# Altium project PCB_Project.PrjPcb
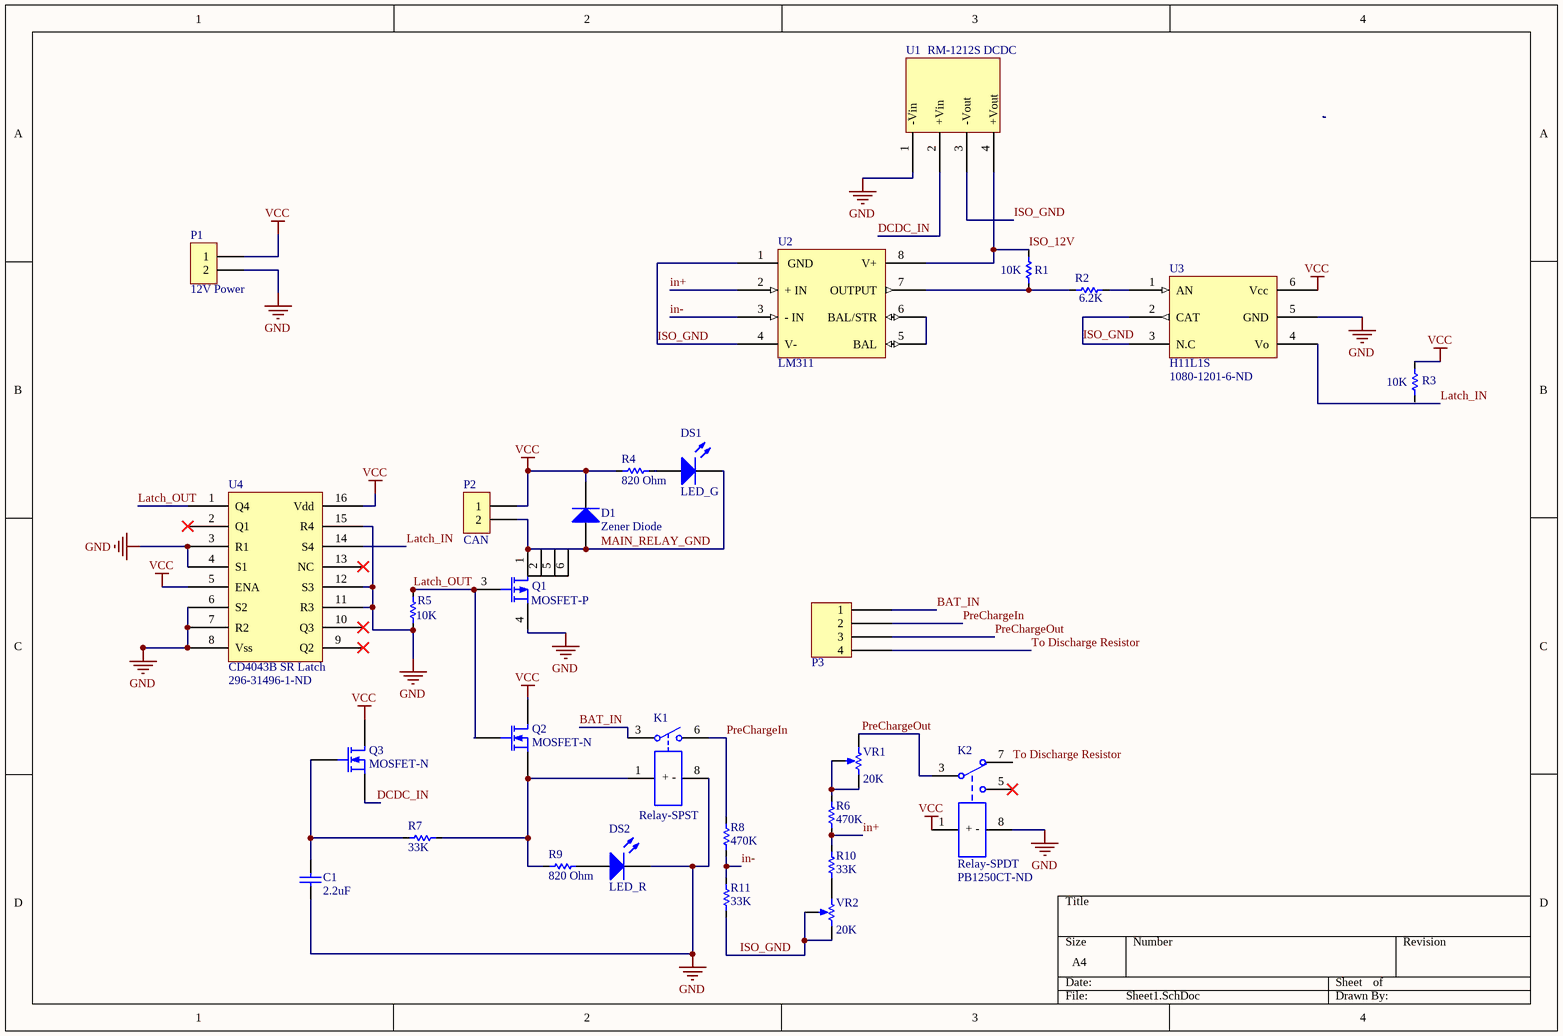
[diagram p0: Sheet1.SchDoc]
1 sheet, 29 parts. Net scope: global (net labels, ports and power ports of the same name join across sheets).

## Sheet Sheet1.SchDoc
size A4

### Parts
C1  2.2uF  [0603]
D1  Zener Diode  [DO-214AA Diode]
DS1  LED_G  [LED_0603]
DS2  LED_R  [LED_0603]
K1  Relay-SPST  [MODULE4]
K2  Relay-SPDT  Supplier Part Number 1: PB1250CT-ND  [RELAY_SPDT]
P1  12V Power  [WM9811CT-ND]
P2  CAN  [WM4780CT-ND]
P3  4 Position Clik-Mate HV Surface Mount  [WM2282CT-ND]  (value not drawn)
Q1  MOSFET-P  [P-MOSFET]
Q2  MOSFET-N  [N-CH MOSFET SOT-23]
Q3  MOSFET-N  [N-CH MOSFET SOT-23]
R1  10K  [RES_0603]
R2  value 6.2K  [RES_0603]  (hidden comment: RES SMD 6.2K OHM 5% 1/10W 0603)
R3  10K  [RES_0603]
R4  820 Ohm  [RES_0603]
R5  10K  [RES_0603]
R6  470K  [RES_0603]
R7  33K  [RES_0603]
R8  470K  [RES_0603]
R9  820 Ohm  [RES_0603]
R10  33K  [RES_0603]
R11  33K  [RES_0603]
U1  RM-1212S DCDC  [RM-1212S]
U2  LM311  [SOIC8]
U3  H11L1S  Supplier Part Number 1: 1080-1201-6-ND  [H11LS]
U4  CD4043B SR Latch  Supplier Part Number 1: 296-31496-1-ND  [CD4043BDR-16SOIC]
VR1  value 20K  [20K POT]  (hidden comment: 20k 0.25W Pot)
VR2  value 20K  [20K POT]  (hidden comment: 20k 0.25W Pot)

### Nets
GND: C1.1 DS2.2(K) K1.8(-) K2.8(-) P1.2 Q1.4(S) R5.1 U1.1(-Vin) U3.5(GND) U4.3(R1) U4.4(S1) U4.6(S2) U4.7(R2) U4.8(Vss) U4.11(R3) U4.12(S3) U4.15(R4)
VCC: D1.2(K) K2.1(+) P1.1 P2.1 Q2.3(D) Q3.3(D) R3.2 R4.1 U3.6(Vcc) U4.5(ENA) U4.16(Vdd)
BAT_IN: K1.3 P3.1
DCDC_IN: Q3.2(S) U1.2(+Vin)
in+: R6.1 R10.2 U2.2(+_IN)
in-: R8.1 R11.2 U2.3(-_IN)
ISO_12V: R1.2 U1.4(+Vout) U2.8(V+)
ISO_GND: R11.1 U1.3(-Vout) U2.1(GND) U2.4(V-) U3.2(CAT) U3.3(N.C) VR2.2(TAP) VR2.3(BOT)
Latch_IN: U3.4(Vo) U4.14(S4)
Latch_OUT: Q1.3(G) Q2.1(G) R5.2 U4.1(Q4)
MAIN_RELAY_GND: D1.1(A) DS1.2(K) P2.2 Q1.1(D)
PreChargeIn: K1.6 P3.2 R8.2
PreChargeOut: K2.3 P3.3 VR1.1(TOP)
To Discharge Resistor: K2.7 P3.4
NetC1_2: C1.2 Q3.1(G) R7.2
NetDS1_1: DS1.1(A) R4.2
NetDS2_1: DS2.1(A) R9.2
NetK1_1: K1.1(+) Q2.2(S) R7.1 R9.1
NetR1_1: R1.1 R2.1 U2.7(OUTPUT)
NetR2_2: R2.2 U3.1(AN)
NetR6_2: R6.2 VR1.2(TAP) VR1.3(BOT)
NetR10_1: R10.1 VR2.1(TOP)
NetU2_5: U2.5(BAL) U2.6(BAL/STR)

Not connected (* = marked no-connect by the designer): K2 5*; Q1 2(D) 5(D) 6(D); R3 1; U4 2(Q1)* 9(Q2)* 10(Q3)* 13(NC)*

### Notes on the sheet
- (in symbol Relay-SPDT) + -
- (in symbol Relay-SPST) + -

### Library data of the parts
C1 = CAP CER 2.2UF 25V 10% 0603: 2.2µF ±10% 25V Ceramic Capacitor X5R 0603 (1608 Metric); ManufacturerPartNumber: GRM188R61E225KA12D; Manufacturer: Murata Electronics North America; Supplier: Digi-Key; Supplier 1: Digi-Key; Voltage: 25V; Value: 2.2uF; Supplier Part Number 1: 490-10731-1-ND
D1 = Zener Diode: Zener Diode 16V 5W ±5% Surface Mount DO-214AA (SMB); Manufacture: Micro Commercial Co; Manufacture Part Number: SMBJ5353B-TP; Impedence (Max): 2.5 Ohm; Voltage - Forward: 1.2V @ 1A; Voltage - Zener (Nom): 16V; Power (Max): 5W; Supplier 1: Digi-Key; Supplier Part Number 1: SMBJ5353B-TPMSCT-ND
DS1 = LED_G: Green LED 0603; Manufacture: Lite-On Inc.; Manufacture Part Number: LTST-C191KGKT; Forward Voltage: 2.0V; Forward Current: 20mA (max 30); Package: 0603; Color: Green; Supplier 1: Digi-Key; Supplier Part Number 1: 160-1446-1-ND
DS2 = LED_R: Red LED 0603; Manufacture: Lite-On Inc.; Manufacture Part Number: LTST-C191KRKT; Forward Voltage: 2.0V; Forward Current: 20mA (max 30); Package: 0603; Color: Red; Supplier 1: Digi-Key; Supplier Part Number 1: 160-1447-1-ND
K1 = Relay-SPST: Telecom Relay SPST-NO (1 Form A) Surface Mount; Manufacture: TE Connectivity Potter & Brumfield Relays; Manufacture Part Number: 1462041-3; Coil Type: 11.7mA; Coil Voltage: 12VDC; Contact Rating: 2A; Switching Voltage: 250VAC, 220VDC - Max; Operate Time: 3ms; Contact Form: SPST-NO; Supplier 1: Digi-Key; Supplier Part Number 1: PB1248CT-ND
K2 = Relay-SPDT: Telecom Relay SPDT (1 Form C) Surface Mount; Manufacturer Part Number: 1462042-9; Coil Type: Non Latching; Switching Voltage: 250VAC, 220VDC; Operate Time: 3ms; Coil Power: 140 mW; Coil Voltage: 12V; Contact Form: SPDT; Supplier 1: Digi-Key
P1 = 2 Position Clik-Mate 12V Connector: 2 Position Receptacle Connector 0.059" (1.50mm) Surface Mount Tin; Manufacturer Part Number: 5025840270; Digikey Part Number: WM9811CT-ND; Supplier 1: Digi-Key; Supplier Part Number 1: WM9811CT-ND
P2 = 2 Position Clik-Mate CAN Connector: 2 Position Receptacle Connector 0.049" (1.25mm) Surface Mount Tin; Manufacturer Part Number: 5023820270; Digikey Part Number: WM4780CT-ND; Supplier 1: Digi-Key; Supplier Part Number 1: WM4780CT-ND
P3 = 4 Position Clik-Mate HV Surface Mount: 4 Position Receptacle Connector 0.079" (2.00mm) Surface Mount, Right Angle Tin; Number of Positions: 4; Number of Rows: 1; Pitch: 0.079" (2.00mm); Mounting Type: Surface Mount, Right Angle; Supplier 1: Digi-Key; Supplier Part Number 1: WM2282CT-ND
Q1 = MOSFET-P: MOSFET P-CH 30V 4A SOT23-6; Vendor Part Number: 497-15521-1-ND; Manufacture: STMicroelectronics; Manufacture Part Number: STT4P3LLH6; Vendor: Digi-Key; Current - Cont Drain: 4A (Ta); FET Type: MOSFET P-Channel, Metal Oxide; Drain to Source Voltage (Vdss): 30V; Package: SOT-23-6; Supplier 1: Digi-Key; Supplier Part Number 1: 497-15521-1-ND
Q2 Q3 = MOSFET-N: MOSFET N-CH 50V 200MA SOT23-3; Manufacture: Diodes Incorporated; Manufacture Part Number: BSS138-7-F; Vendor Part Number: 497-3177-1-ND; Vendor: Digi-Key; Supplier 1: Digi-Key; Supplier Part Number 1: BSS138-FDICT-ND
R1 R3 R5 = RES SMD 10K OHM 1% 1/10W 0603: Manufacture: Yageo; Manufacture Part Number: RC0603FR-0710KL; Vendor Part Number: 311-10.0KHRCT-ND; Vendor: Digi-Key; Tolerence: 1%; Power: 1/10W; Package: 0603; Supplier 1: Digi-Key; Supplier Part Number 1: 311-10.0KHRTR-ND; Value: 10K
R2 = RES SMD 6.2K OHM 5% 1/10W 0603: Manufacture: Yageo; Manufacture Part Number: RC0603JR-076K2L; Vendor Part Number: 311-6.2KGRCT-ND; Vendor: Digi-Key; Power: 0.25W; Tolerence: 5%; Package: 0603
R4 R9 = RES SMD 820 OHM 5% 1/4W 0603: Manufacture: Rohm Semiconductor; Manufacture Part Number: ESR03EZPJ821; Power: 1/10W; Tolerence: 5%; Package: 0603; Supplier 1: Digi-Key; Supplier Part Number 1: RHM820DCT-ND; Value: 820 Ohm
R6 R8 = RES 470K OHM 1% 1/4W 0603: RES SMD 470K OHM 1% 1/4W 0603; Manufacture: Panasonic Electronic Components; Manufacture Part Number: ERJ-PA3F4703V; Vendor: Digi-Key; Power: 0.25W; Tolerence: 1%; Package: 0603; Supplier 1: Digi-Key; Value: 470K; Supplier Part Number 1: P470KBYCT-ND
R7 R10 R11 = RES 33K OHM 1% 1/4W 0603: Manufacture: Panasonic Electronic Components; Manufacture Part Number: ERJ-PA3F3302V; Vendor Part Number: P47KBYCT-ND; Vendor: Digi-Key; Power: 0.25W; Tolerence: 1%; Package: 0603; Value: 33K; Supplier 1: Digi-Key; Supplier Part Number 1: P33KBYCT-ND
U3 = H11L1S: OPTOISO 5KV OPEN COLLECTOR 6SMD; Supplier 1: Digi-Key
U4 = CD4043B SR Latch: S-R Latch 4 Channel 1:1 IC Tri-State 16-TSSOP; Manufacture: Texas Instruments; Delay Time: 50ns; Supply Voltage: 3-18V; Output Type: Tri-State; Package: 16SOIC; Supplier 1: Digi-Key
VR1 VR2 = 20k 0.25W Pot: 20k Ohm 0.25W, 1/4W Gull Wing Surface Mount Trimmer Potentiometer; Manufacture: TT Electronics/BI; Manufacture Part Number: 23BR20KLFTR; Adjustment Type: Top; Turns: 1; Tolerence: 20%; Power: 1/4W; Supplier 1: Digi-Key; Supplier Part Number 1: 987-1016-1-ND
U1 = RM-1212S DCDC: Supplier 1: Digi-Key; Supplier Part Number 1: 945-1209-ND
U2 = LM311: Supplier 1: Digi-Key; Supplier Part Number 1: LM311MNS/NOPB-ND